# Altium schematic sheet USB2JTAG-Interfaces.SchDoc: =ProjectTitle+'-Interfaces'
size A4; SheetNumber: 1; SheetTotal: 3
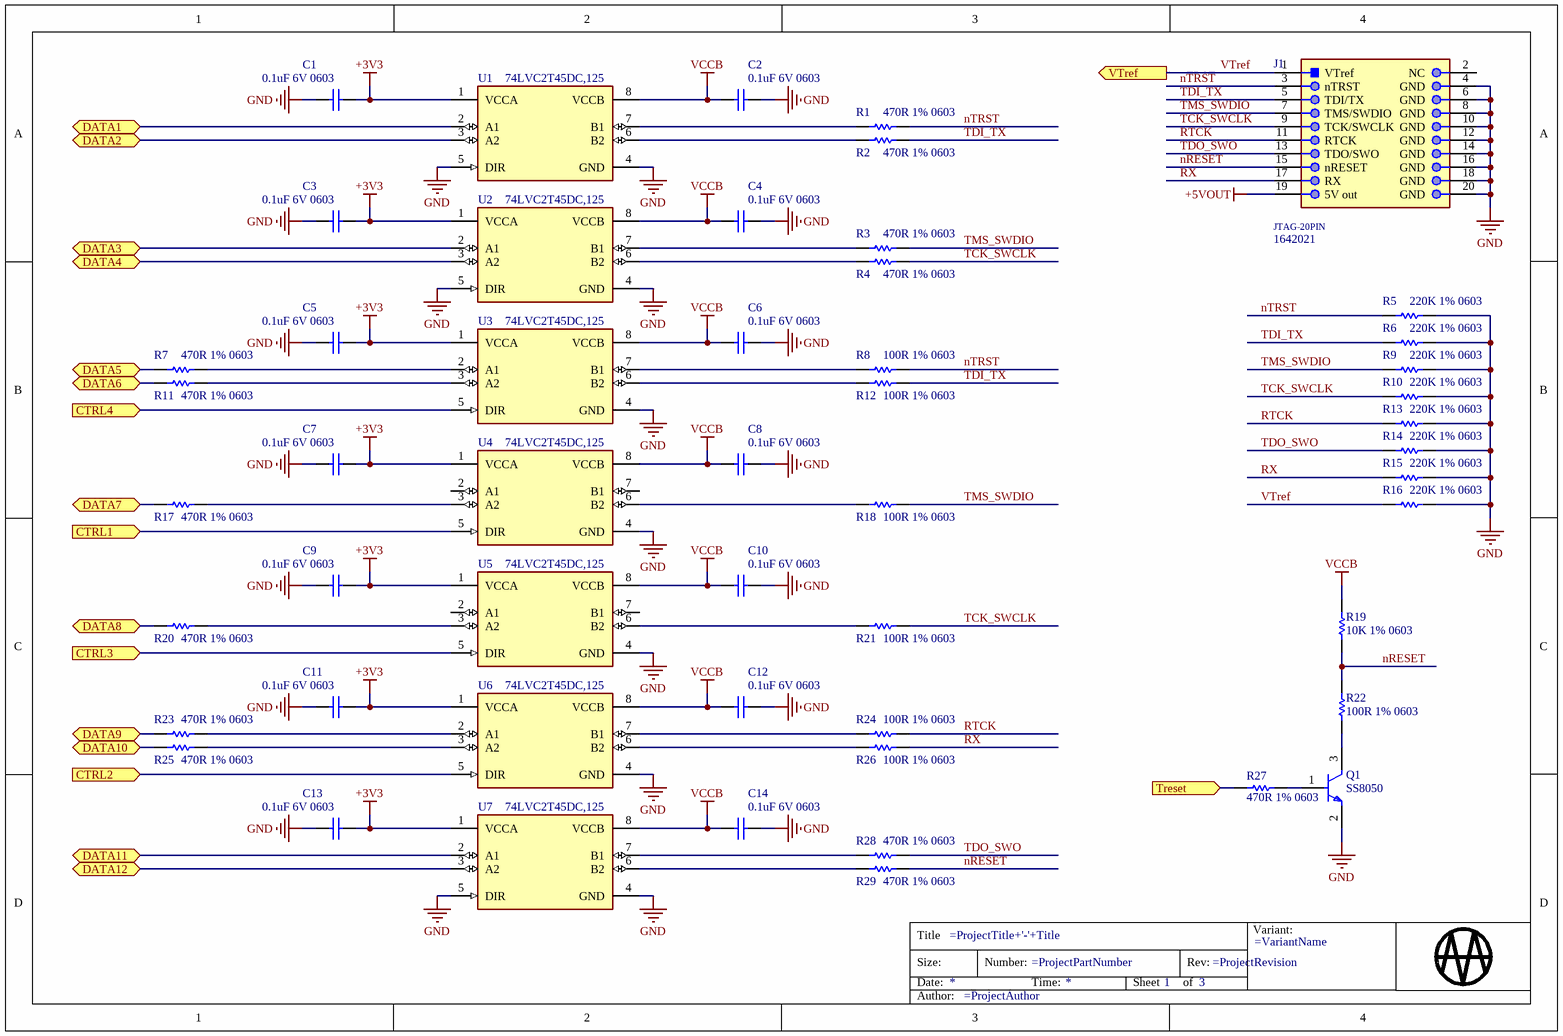
[diagram p0: USB2JTAG-Interfaces.SchDoc]

## Parts
?  Total Sheets: 3  Sheet Number: 1  (hidden comment: Title Block Logo)  (graphical)
C1  0.1uF 6V 0603  [FP-GRM188-0_1-e0_2_0_55-IPC_C-NOSILK]
C2  0.1uF 6V 0603  [FP-GRM188-0_1-e0_2_0_55-IPC_C-NOSILK]
C3  0.1uF 6V 0603  [FP-GRM188-0_1-e0_2_0_55-IPC_C-NOSILK]
C4  0.1uF 6V 0603  [FP-GRM188-0_1-e0_2_0_55-IPC_C-NOSILK]
C5  0.1uF 6V 0603  [FP-GRM188-0_1-e0_2_0_55-IPC_C-NOSILK]
C6  0.1uF 6V 0603  [FP-GRM188-0_1-e0_2_0_55-IPC_C-NOSILK]
C7  0.1uF 6V 0603  [FP-GRM188-0_1-e0_2_0_55-IPC_C-NOSILK]
C8  0.1uF 6V 0603  [FP-GRM188-0_1-e0_2_0_55-IPC_C-NOSILK]
C9  0.1uF 6V 0603  [FP-GRM188-0_1-e0_2_0_55-IPC_C-NOSILK]
C10  0.1uF 6V 0603  [FP-GRM188-0_1-e0_2_0_55-IPC_C-NOSILK]
C11  0.1uF 6V 0603  [FP-GRM188-0_1-e0_2_0_55-IPC_C-NOSILK]
C12  0.1uF 6V 0603  [FP-GRM188-0_1-e0_2_0_55-IPC_C-NOSILK]
C13  0.1uF 6V 0603  [FP-GRM188-0_1-e0_2_0_55-IPC_C-NOSILK]
C14  0.1uF 6V 0603  [FP-GRM188-0_1-e0_2_0_55-IPC_C-NOSILK]
J1  JTAG-20PIN  Supplier Part Number 1: 1642021  [61202021621-Edge-SMT]
Q1  SS8050  [FP-SS8050-G-IPC_B]
R1  470R 1% 0603  [FP-ERA3A-IPC_C-NOSILK]
R2  470R 1% 0603  [FP-ERA3A-IPC_C-NOSILK]
R3  470R 1% 0603  [FP-ERA3A-IPC_C-NOSILK]
R4  470R 1% 0603  [FP-ERA3A-IPC_C-NOSILK]
R5  220K 1% 0603  [FP-ERA3A-IPC_C-NOSILK]
R6  220K 1% 0603  [FP-ERA3A-IPC_C-NOSILK]
R7  470R 1% 0603  [FP-ERA3A-IPC_C-NOSILK]
R8  100R 1% 0603  [FP-ERA3A-IPC_C-NOSILK]
R9  220K 1% 0603  [FP-ERA3A-IPC_C-NOSILK]
R10  220K 1% 0603  [FP-ERA3A-IPC_C-NOSILK]
R11  470R 1% 0603  [FP-ERA3A-IPC_C-NOSILK]
R12  100R 1% 0603  [FP-ERA3A-IPC_C-NOSILK]
R13  220K 1% 0603  [FP-ERA3A-IPC_C-NOSILK]
R14  220K 1% 0603  [FP-ERA3A-IPC_C-NOSILK]
R15  220K 1% 0603  [FP-ERA3A-IPC_C-NOSILK]
R16  220K 1% 0603  [FP-ERA3A-IPC_C-NOSILK]
R17  470R 1% 0603  [FP-ERA3A-IPC_C-NOSILK]
R18  100R 1% 0603  [FP-ERA3A-IPC_C-NOSILK]
R19  10K 1% 0603  [FP-ERA3A-IPC_C-NOSILK]
R20  470R 1% 0603  [FP-ERA3A-IPC_C-NOSILK]
R21  100R 1% 0603  [FP-ERA3A-IPC_C-NOSILK]
R22  100R 1% 0603  [FP-ERA3A-IPC_C-NOSILK]
R23  470R 1% 0603  [FP-ERA3A-IPC_C-NOSILK]
R24  100R 1% 0603  [FP-ERA3A-IPC_C-NOSILK]
R25  470R 1% 0603  [FP-ERA3A-IPC_C-NOSILK]
R26  100R 1% 0603  [FP-ERA3A-IPC_C-NOSILK]
R27  470R 1% 0603  [FP-ERA3A-IPC_C-NOSILK]
R28  470R 1% 0603  [FP-ERA3A-IPC_C-NOSILK]
R29  470R 1% 0603  [FP-ERA3A-IPC_C-NOSILK]
U1  74LVC2T45DC,125  [FP-DCU0008A-MFG]
U2  74LVC2T45DC,125  [FP-DCU0008A-MFG]
U3  74LVC2T45DC,125  [FP-DCU0008A-MFG]
U4  74LVC2T45DC,125  [FP-DCU0008A-MFG]
U5  74LVC2T45DC,125  [FP-DCU0008A-MFG]
U6  74LVC2T45DC,125  [FP-DCU0008A-MFG]
U7  74LVC2T45DC,125  [FP-DCU0008A-MFG]

## Ports
CTRL1 (in), CTRL2 (in), CTRL3 (in), CTRL4 (in), DATA1 (bidir), DATA2 (bidir), DATA3 (bidir), DATA4 (bidir), DATA5 (bidir), DATA6 (bidir), DATA7 (bidir), DATA8 (bidir), DATA9 (bidir), DATA10 (bidir), DATA11 (bidir), DATA12 (bidir), Treset (in), VTref (out)

## Nets
+3V3: C1.1 C3.1 C5.1 C7.1 C9.1 C11.1 C13.1 U1.1(VCCA) U2.1(VCCA) U3.1(VCCA) U4.1(VCCA) U5.1(VCCA) U6.1(VCCA) U7.1(VCCA)
+5VOUT: J1.19(5V_out)
GND: C1.2 C2.1 C3.2 C4.1 C5.2 C6.1 C7.2 C8.1 C9.2 C10.1 C11.2 C12.1 C13.2 C14.1 J1.4(GND) J1.6(GND) J1.8(GND) J1.10(GND) J1.12(GND) J1.14(GND) J1.16(GND) J1.18(GND) J1.20(GND) Q1.2(E) R5.2 R6.2 R9.2 R10.2 R13.2 R14.2 R15.2 R16.2 U1.4(GND) U1.5(DIR) U2.4(GND) U2.5(DIR) U3.4(GND) U4.4(GND) U5.4(GND) U6.4(GND) U7.4(GND) U7.5(DIR)
VCCB: C2.2 C4.2 C6.2 C8.2 C10.2 C12.2 C14.2 R19.1 U1.8(VCCB) U2.8(VCCB) U3.8(VCCB) U4.8(VCCB) U5.8(VCCB) U6.8(VCCB) U7.8(VCCB)
CTRL1: U4.5(DIR) ; port CTRL1
CTRL2: U6.5(DIR) ; port CTRL2
CTRL3: U5.5(DIR) ; port CTRL3
CTRL4: U3.5(DIR) ; port CTRL4
DATA1: U1.2(A1) ; port DATA1
DATA2: U1.3(A2) ; port DATA2
DATA3: U2.2(A1) ; port DATA3
DATA4: U2.3(A2) ; port DATA4
DATA5: R7.1 ; port DATA5
DATA6: R11.1 ; port DATA6
DATA7: R17.1 ; port DATA7
DATA8: R20.1 ; port DATA8
DATA9: R23.1 ; port DATA9
DATA10: R25.1 ; port DATA10
DATA11: U7.2(A1) ; port DATA11
DATA12: U7.3(A2) ; port DATA12
nRESET: J1.15(nRESET) R19.2 R22.1 R29.2
nTRST: J1.3(nTRST) R1.2 R5.1 R8.2
RTCK: J1.11(RTCK) R13.1 R24.2
RX: J1.17(RX) R15.1 R26.2
TCK_SWCLK: J1.9(TCK/SWCLK) R4.2 R10.1 R21.2
TDI_TX: J1.5(TDI/TX) R2.2 R6.1 R12.2
TDO_SWO: J1.13(TDO/SWO) R14.1 R28.2
TMS_SWDIO: J1.7(TMS/SWDIO) R3.2 R9.1 R18.2
Treset: R27.2 ; port Treset
VTref: J1.1(VTref) R16.1 ; port VTref
NetQ1_1: Q1.1(B) R27.1
NetQ1_3: Q1.3(C) R22.2
NetR1_1: R1.1 U1.7(B1)
NetR2_1: R2.1 U1.6(B2)
NetR3_1: R3.1 U2.7(B1)
NetR4_1: R4.1 U2.6(B2)
NetR7_2: R7.2 U3.2(A1)
NetR8_1: R8.1 U3.7(B1)
NetR11_2: R11.2 U3.3(A2)
NetR12_1: R12.1 U3.6(B2)
NetR17_2: R17.2 U4.3(A2)
NetR18_1: R18.1 U4.6(B2)
NetR20_2: R20.2 U5.3(A2)
NetR21_1: R21.1 U5.6(B2)
NetR23_2: R23.2 U6.2(A1)
NetR24_1: R24.1 U6.7(B1)
NetR25_2: R25.2 U6.3(A2)
NetR26_1: R26.1 U6.6(B2)
NetR28_1: R28.1 U7.7(B1)
NetR29_1: R29.1 U7.6(B2)

Not connected (* = marked no-connect by the designer): J1 2(NC); U4 2(A1) 7(B1); U5 2(A1) 7(B1)

## Notes on the sheet
- Title
- Size:
- Date:
- A4
- Number:
- Time:
- Revision:
- Sheet
- of
- File:
- (in symbol Title Block MAA) Variant:; Title; Size:; Number:; Rev:; Date:; Time:; Sheet; of; Author:

## Library data of the parts
? = Title Block MAA: Sheet Title: =ProjectTitle+'-'+Title; Document Number: =ProjectPartNumber; Revision Number: =ProjectRevision; Organization Address 1: =VariantName; Date: *; Time: *; Document Path and Name: =ProjectAuthor
C1-C14 = CAP0603: 50V 100nF X7R ±5% 0603 Multilayer Ceramic Capacitors MLCC - SMD/SMT ROHS; Manufacturer: Walsin Tech Corp; Manufacturer Part Number: 0603B104J500CT; Supplier 1: LCSC; Supplier Part Number 1: C119027; Case/Package: 0603
  C2: ComponentLink1Description: Datasheet; ComponentLink1URL: https://datasheet.lcsc.com/lcsc/1811151131_Walsin-Tech-Corp-0603B104J500CT_C119027.pdf
J1 = JTAG-20PIN: Male Box Header WR-BHD, THT, Vertical, pitch 2.54 mm, 20 pins; Manufacturer: Wurth Elektronik; Part Number: 61202021621; Contact Resistance: 20mOhm; Withstanding Voltage: 500VAC; Pitch: 2.54mm; Pin Number: 20; Working Voltage: 250VAC; Current Rating: 3A; Voltage Rating: 250V; Insulation Resistance: 1GR; Connector Type: Male Pin; Insulation: Insulated; Row Spacing: 0.1inch; Orientation: Vertical; Package Reference: 61202021621; Publisher: WurthElektronik; Datasheet URL: https://katalog.we-online.de/em/datasheet/6120xx21621.pdf; Operating Temperature: -40to125degC; Packaging: Tray; Mounting Technology: THT; Gender: Male; Manufacturer URL: http://www.we-online.de; Published Date: August2018; Supplier 1: Farnell; Manufacturer Part Number: 61202021621; RoHS: Yes; Category: Headers and Wire Housings; Stock 1: 1948; Pricing 1: 1=0,93000, 10=0,84200, 100=0,66700, 500=0,65400, 1000=0,64000, 2500=0,62700 (EUR); Mount: Through Hole; Contact Plating: Gold; Contact Material: Copper Alloy,Copper; Color: Black; Housing Material: PBT; Min Operating Temperature: -40°C; Max Operating Temperature: 125°C; Number of Rows: 2; Package Quantity: 160; Contact Gender: Male; Number of Positions: 20; Termination: Through Hole; Number of Contacts: 20; Series: WR-BHD; Contact Type: Male Pin; Length: 33.06mm; Width: 33.06mm; Height: 8.85mm; REACH SVHC: Unknown; Flammability Rating: UL94 V-0; RoHS Compliant: Yes; ComponentLink1URL: https://datasheet.ciiva.com/731/6120xx21621-731346.pdf?src-supplier=Digi-Key; ComponentLink1Description: https://datasheet.ciiva.com/731/6120xx21621-731346.pdf?src-supplier=Digi-Key
Q1 = CMP-20235-000001-1: 100nA 25V 300mW 1.5A 200@100mA,1V 100MHz 500mV@800mA,80mA NPN +150℃@(Tj) SOT-23(SOT-23-3) Bipolar Transistors - BJT ROHS; Manufacturer: JCST; Case/Package: SOT-23-3; Supplier 1: LCSC; Supplier Part Number 1: C2150; Manufacturer Part Number: SS8050; ComponentLink1Description: datasheet; ComponentLink1URL: https://datasheet.lcsc.com/lcsc/1811052004_Jiangsu-Changjing-Electronics-Technology-Co---Ltd--SS8050_C2150.pdf
R1-R4 R7 R11 R17 R20 R23 R25 R27-R29 = RES0603: 100mW 75V ±100ppm/℃ ±1% -55℃~+155℃ 470Ω 0603 Chip Resistor - Surface Mount ROHS; Manufacturer: YAGEO; Manufacturer Part Number: RC0603FR-07470RL; Case/Package: 0603; Supplier 1: LCSC; Supplier Part Number 1: C114669
  R1: ComponentLink1Description: Datasheet; ComponentLink1URL: https://datasheet.lcsc.com/lcsc/1810161617_YAGEO-RC0603FR-07470RL_C114669.pdf
R5 R6 R9 R10 R13-R16 = RES0603: 100mW Thick Film Resistors 75V ±100ppm/℃ ±1% -55℃~+155℃ 220kΩ 0603 Chip Resistor - Surface Mount ROHS; Manufacturer: UNI-ROYAL(Uniroyal Elec); Manufacturer Part Number: 0603WAF2203T5E; Case/Package: 0603; Supplier 1: LCSC; Supplier Part Number 1: C22961
  R5: ComponentLink1Description: Datasheet; ComponentLink1URL: https://datasheet.lcsc.com/lcsc/2206010130_UNI-ROYAL-Uniroyal-Elec-0603WAF2203T5E_C22961.pdf
R8 R12 R18 R21 R22 R24 R26 = RES0603: 100mW Thick Film Resistors 75V ±1% ±100ppm/℃ 100Ω -55℃~+155℃ 0603 Chip Resistor - Surface Mount ROHS; Manufacturer: YAGEO; Manufacturer Part Number: RC0603FR-07100RL; Case/Package: 0603; Supplier 1: LCSC; Supplier Part Number 1: C105588
  R8: ComponentLink1Description: Datasheet; ComponentLink1URL: https://datasheet.lcsc.com/lcsc/1810231425_YAGEO-RC0603FR-07100RL_C105588.pdf
R19 = RES0603: 0.1W ±1% 10kΩ 0603 Chip Resistor - Surface Mount ROHS; Manufacturer: TyoHM; Manufacturer Part Number: RMC 0603 10K F N; Case/Package: 0603; Supplier 1: LCSC; Supplier Part Number 1: C269701; ComponentLink1Description: Datasheet; ComponentLink1URL: https://datasheet.lcsc.com/lcsc/1811101830_TyoHM-RMC-0603-10K-F-N_C269701.pdf
U1-U7 = 74LVC2T45DC: 1.2V~5.5V Tri-State，Unidirectional Voltage Level Translators -40℃~+125℃ 1.2V~5.5V Bi-Directional Voltage Levels 1 2 420Mbps VSSOP-8 Translators / Level Shifters ROHS; Manufacturer: Nexperia; Manufacturer Part Number: 74LVC2T45DC,125; Supplier 1: LCSC; Supplier Part Number 1: C730237; ComponentLink1Description: Datasheet; ComponentLink1URL: https://datasheet.lcsc.com/lcsc/2201131100_Nexperia-74LVC2T45DC-125_C730237.pdf; Case/Package: VSSOP-8